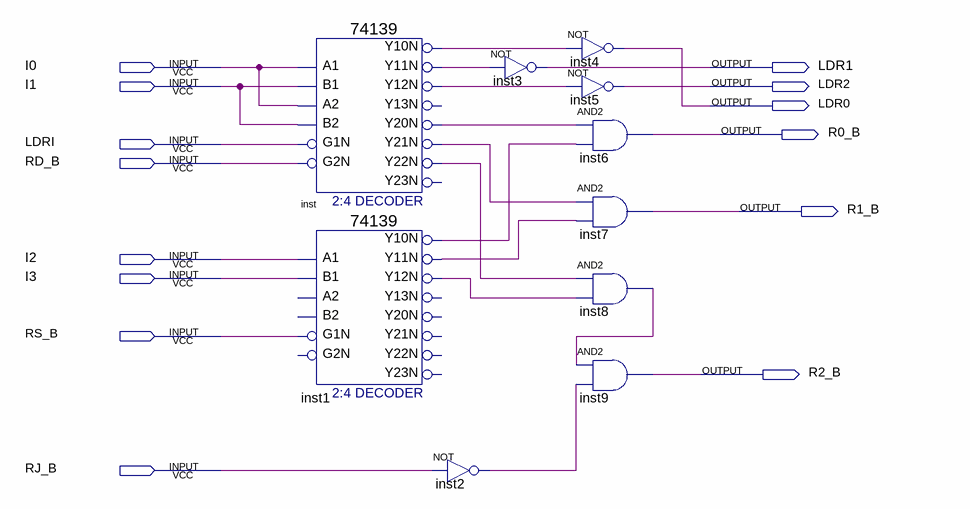
[diagram p0: schematic sheet]
// Quartus schematic LDR0_2.bdf as structural Verilog: 10 symbols, 14 pins
module LDR0_2 (
  input  I0,
  input  I1,
  input  LDRI,
  input  RD_B,
  input  I2,
  input  I3,
  input  RS_B,
  input  RJ_B,
  output LDR1,
  output LDR2,
  output LDR0,
  output R0_B,
  output R1_B,
  output R2_B
);

  wire inst1_y10n, inst1_y11n, inst1_y12n, inst2_out, inst8_out, inst_y10n, inst_y11n, inst_y12n, inst_y20n,
       inst_y21n, inst_y22n;

  \74139  inst (
    .A1(I0), .A2(I0), .B1(I1), .B2(I1), .G1N(LDRI), .G2N(RD_B), .Y10N(inst_y10n), .Y20N(inst_y20n),
    .Y12N(inst_y12n), .Y11N(inst_y11n), .Y21N(inst_y21n), .Y22N(inst_y22n));  // open: Y13N, Y23N
  \74139  inst1 (
    .A1(I2), .B1(I3), .G1N(RS_B), .Y10N(inst1_y10n), .Y12N(inst1_y12n), .Y11N(inst1_y11n));  // open: A2, B2, G2N, Y20N, Y13N, Y21N, Y22N, Y23N
  not inst2 (inst2_out, RJ_B);
  not inst3 (LDR1, inst_y11n);
  not inst4 (LDR0, inst_y10n);
  not inst5 (LDR2, inst_y12n);
  and inst6 (R0_B, inst_y20n, inst1_y10n);
  and inst7 (R1_B, inst_y21n, inst1_y11n);
  and inst8 (inst8_out, inst_y22n, inst1_y12n);
  and inst9 (R2_B, inst8_out, inst2_out);
endmodule
